# Altium schematic sheet proteccionBat.SchDoc
size A4
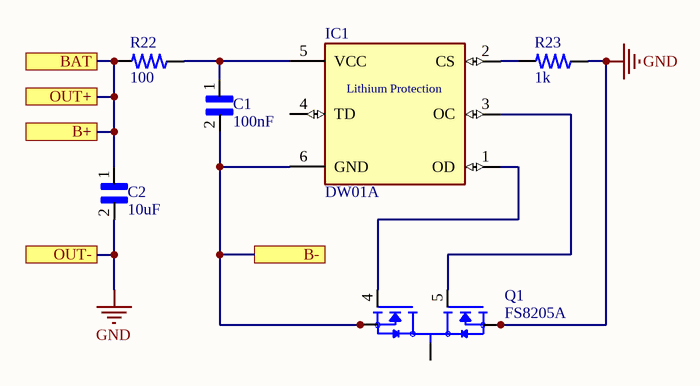
[diagram p0: proteccionBat.SchDoc]

## Parts
C1  100nF  [CAPC1608X87N]
C2  10uF  [CAPC1608X87N]
IC1  DW01A  [SOT23-6]
Q1  FS8205A  [SOP65P640X120-8N]
R22  100  [RESC1608X50N]
R23  1k  [RESC1608X50N]

## Ports
B+, B-, BAT, OUT+, OUT-

## Nets
GND: C2.2 Q1.6(S2) Q1.7(S2) R23.1 ; port OUT-
B+: C2.1 R22.2 ; port BAT, port OUT+, port B+
B-: C1.2 IC1.6(GND) Q1.2(S1) Q1.3(S1) ; port B-
NetC1_1: C1.1 IC1.5(VCC) R22.1
NetIC1_1: IC1.1(OD) Q1.4(G1)
NetIC1_2: IC1.2(CS) R23.2
NetIC1_3: IC1.3(OC) Q1.5(G2)
NetQ1_1: Q1.1(D12) Q1.8(D12)

Not connected (* = marked no-connect by the designer): IC1 4(TD)

## Notes on the sheet
- (in symbol DW01A) Lithium Protection

## Library data of the parts
C1 C2 = MC0603B105K160CT: Cap, Mlcc, X7r, 1uf, 16v, 0603; MF: Multicomp; SnapEDA_Link: https://www.snapeda.com/parts/MC0603B105K160CT/Multicomp/view-part/276886/?ref=snap; Value: *; Price: None; Availability: Unavailable; MP: MC0603B105K160CT; Package: 0603 Multicomp
IC1 = DW01A: Pushbutton Switch SPST-NC Standard Panel Mount, Front; MF: Fortune Semiconductor; Price: None; Availability: Unavailable; Package: Package Analog Devices; SnapEDA_Link: https://www.snapeda.com/parts/DW01A/Fortune%20Semiconductor/view-part/4388554/?ref=snap; MP: DW01A; Value: *
Q1 = FS8205A: N/A; MF: Fortune Semiconductor; Value: *; Price: None; Package: Package Analog Devices; SnapEDA_Link: https://www.snapeda.com/parts/FS8205A/Fortune%20Semiconductor/view-part/3217108/?ref=snap; Availability: Unavailable; MP: FS8205A
R22 R23 = RP73D1J13RBTDG: Res, Thin Film, 13r, 0.1%, 0.1w, 0603; MF: TE Connectivity; MP: RP73D1J13RBTDG; Availability: Unavailable; SnapEDA_Link: https://www.snapeda.com/parts/RP73D1J13RBTDG/TE%20Connectivity/view-part/970906/?ref=snap; Package: 0603 TE Connectivity / AMP; Price: None; TE_purchase_URL: https://www.te.com/usa-en/product-RP73D1J13RBTDG.html?te_bu=Cor&te_type=disp&te_campaign=seda_glo_cor-seda-global-disp-prtnr-fy19-seda-model-bom-cta_sma-317_1&elqCampaignId=32493; Value: *